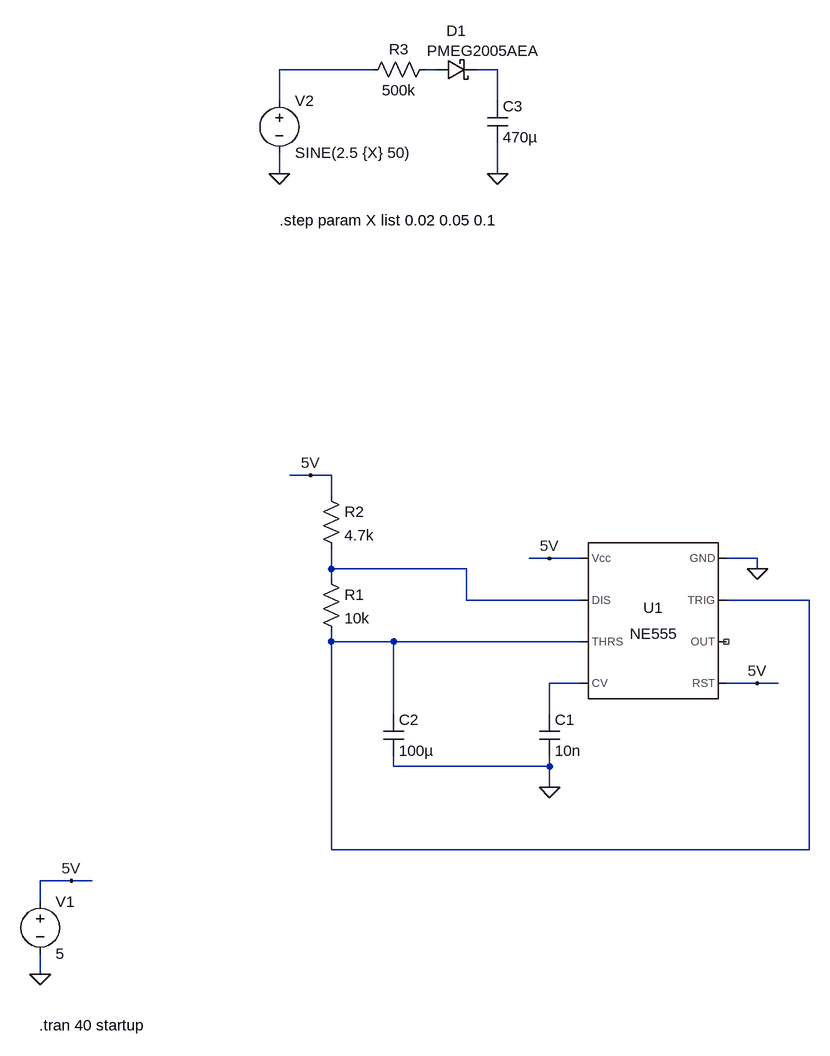
[diagram p0: schematic HeaterControl.asc]
HeaterControl.asc, the LTspice schematic file:
Version 4
SHEET 1 1304 768
WIRE -272 -720 -416 -720
WIRE -176 -720 -192 -720
WIRE -80 -720 -112 -720
WIRE -416 -672 -416 -720
WIRE -80 -672 -80 -720
WIRE -416 -560 -416 -592
WIRE -80 -560 -80 -608
WIRE -368 -96 -400 -96
WIRE -336 -96 -368 -96
WIRE -336 -64 -336 -96
WIRE 0 32 -32 32
WIRE 48 32 0 32
WIRE 320 32 272 32
WIRE -336 48 -336 16
WIRE -128 48 -336 48
WIRE 320 48 320 32
WIRE -336 64 -336 48
WIRE -128 96 -128 48
WIRE 48 96 -128 96
WIRE 400 96 272 96
WIRE -336 160 -336 144
WIRE -240 160 -336 160
WIRE 48 160 -240 160
WIRE 48 224 0 224
WIRE 320 224 272 224
WIRE 352 224 320 224
WIRE -240 272 -240 160
WIRE 0 272 0 224
WIRE -240 352 -240 336
WIRE 0 352 0 336
WIRE 0 352 -240 352
WIRE 0 384 0 352
WIRE -336 480 -336 160
WIRE 400 480 400 96
WIRE 400 480 -336 480
WIRE -736 528 -784 528
WIRE -704 528 -736 528
WIRE -784 560 -784 528
WIRE -784 672 -784 640
FLAG -784 672 0
FLAG -736 528 5V
FLAG 320 48 0
FLAG 0 32 5V
FLAG 320 224 5V
FLAG 0 384 0
FLAG -368 -96 5V
FLAG -416 -560 0
FLAG -80 -560 0
SYMBOL Misc\\NE555 160 128 M0
SYMATTR InstName U1
SYMBOL voltage -784 544 R0
WINDOW 123 0 0 Left 0
WINDOW 39 0 0 Left 0
SYMATTR InstName V1
SYMATTR Value 5
SYMBOL cap -16 272 R0
SYMATTR InstName C1
SYMATTR Value 10n
SYMBOL cap -256 272 R0
SYMATTR InstName C2
SYMATTR Value 100µ
SYMBOL res -352 48 R0
SYMATTR InstName R1
SYMATTR Value 10k
SYMBOL res -352 -80 R0
SYMATTR InstName R2
SYMATTR Value 4.7k
SYMBOL voltage -416 -688 R0
WINDOW 123 0 0 Left 0
WINDOW 39 0 0 Left 0
SYMATTR InstName V2
SYMATTR Value SINE(2.5 {X} 50)
SYMBOL res -176 -736 R90
WINDOW 0 0 56 VBottom 2
WINDOW 3 32 56 VTop 2
SYMATTR InstName R3
SYMATTR Value 500k
SYMBOL schottky -176 -736 M90
WINDOW 0 -28 33 VBottom 2
WINDOW 3 -29 73 VTop 2
SYMATTR InstName D1
SYMATTR Value PMEG2005AEA
SYMATTR Description Diode
SYMATTR Type diode
SYMBOL cap -96 -672 R0
SYMATTR InstName C3
SYMATTR Value 470µ
TEXT -786 750 Left 2 !.tran 40 startup
TEXT -416 -488 Left 2 !.step param X list 0.02 0.05 0.1

The netlist it stands for:
* HeaterControl.asc
XU1 0 N005 NC_01 5V N006 N005 N004 5V NE555  ; pins GND TRIG OUT RST CV THRS DIS Vcc
V1 5V 0 5
C1 N006 0 10n
C2 N005 0 100µ
R1 N004 N005 10k
R2 5V N004 4.7k
V2 N001 0 SINE(2.5 {X} 50)
R3 N002 N001 500k
D1 N002 N003 PMEG2005AEA
C3 N003 0 470µ
.model D D
.lib standard.dio
.tran 40 startup
.step param X list 0.02 0.05 0.1
.lib NE555.sub
.backanno
.end